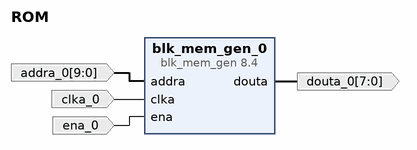
[diagram p0: block diagram of the top level]
# Vivado block design ROM, xc7z020clg484-3, Vivado 2018.3
create_bd_design ROM

create_bd_port -dir I -from 9 -to 0 addra_0
create_bd_port -dir I -type clk clka_0
create_bd_port -dir O -from 7 -to 0 douta_0
create_bd_port -dir I ena_0

create_bd_cell -type ip -vlnv xilinx.com:ip:blk_mem_gen:8.4 blk_mem_gen_0
set_property -dict [list \
  CONFIG.Coe_File ../../../../../../../EXE3.coe \
  CONFIG.Enable_32bit_Address false \
  CONFIG.Load_Init_File true \
  CONFIG.Memory_Type Single_Port_ROM \
  CONFIG.Port_A_Write_Rate 0 \
  CONFIG.Register_PortA_Output_of_Memory_Primitives true \
  CONFIG.Use_RSTA_Pin false \
  CONFIG.Write_Depth_A 1024 \
  CONFIG.Write_Width_A 8 \
  CONFIG.use_bram_block Stand_Alone \
] [get_bd_cells blk_mem_gen_0]

# ---- connections ----

connect_bd_net -net addra_0_1 [get_bd_ports addra_0] [get_bd_pins blk_mem_gen_0/addra]
connect_bd_net -net clka_0_1 [get_bd_ports clka_0] [get_bd_pins blk_mem_gen_0/clka]
connect_bd_net [get_bd_pins blk_mem_gen_0/douta] [get_bd_ports douta_0]
connect_bd_net -net ena_0_1 [get_bd_ports ena_0] [get_bd_pins blk_mem_gen_0/ena]

validate_bd_design
save_bd_design
